# EAGLE design bitfury 10_1403 (EAGLE 6.5.0)
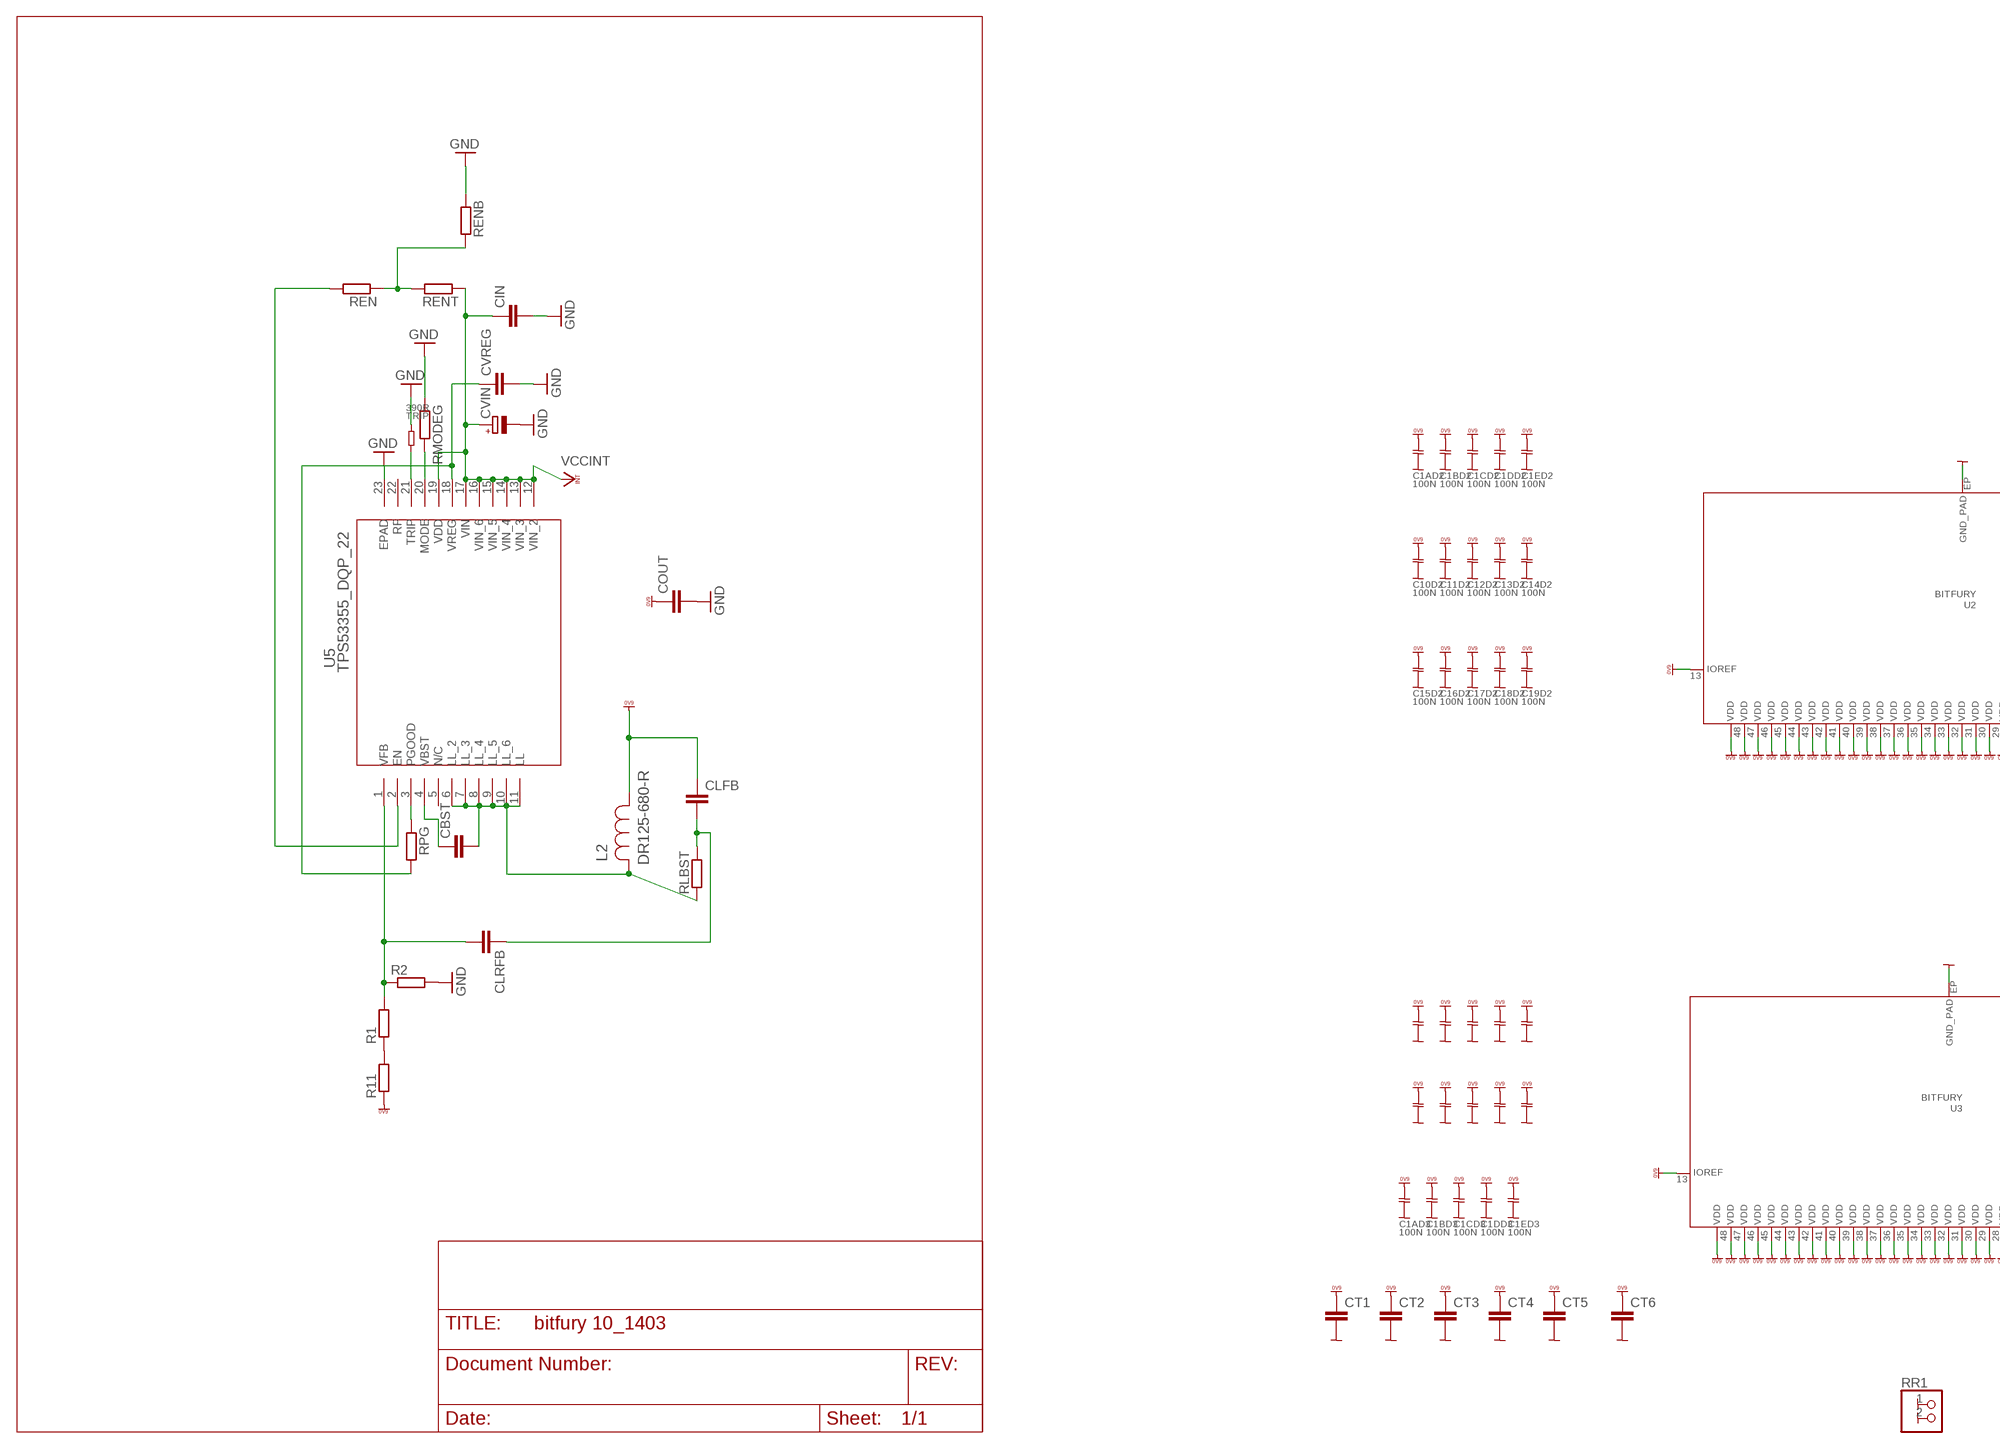
[diagram p0: schematic, sheet 1, part 1 of 3]
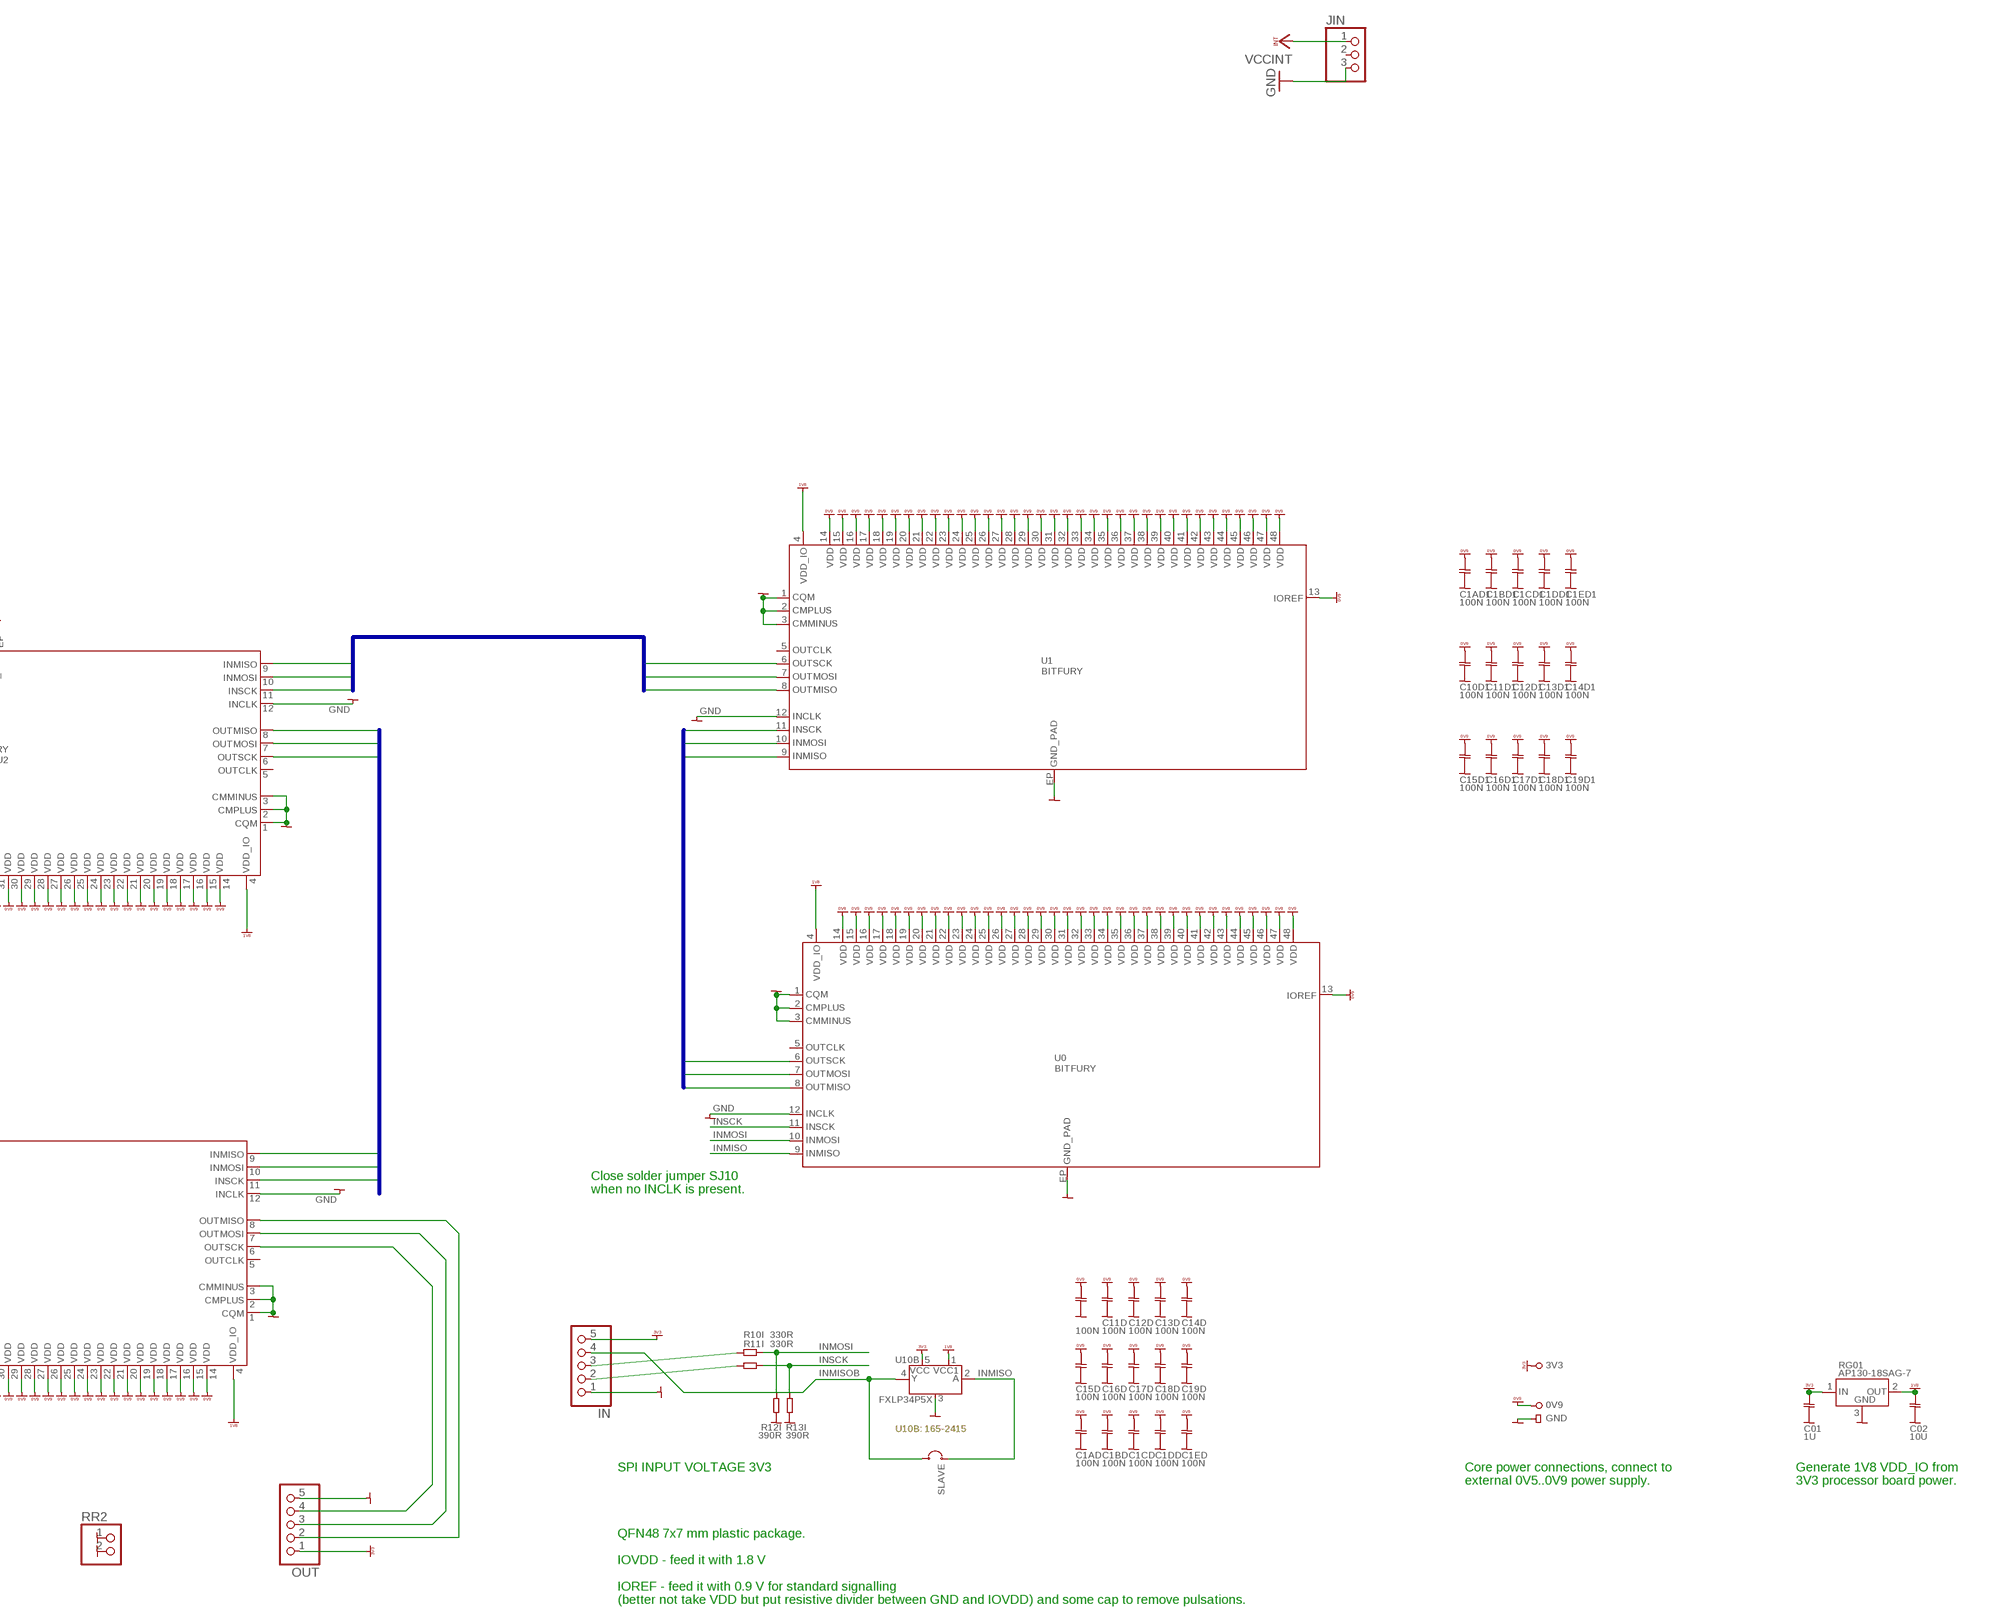
[diagram p1: schematic, sheet 1, part 2 of 3]
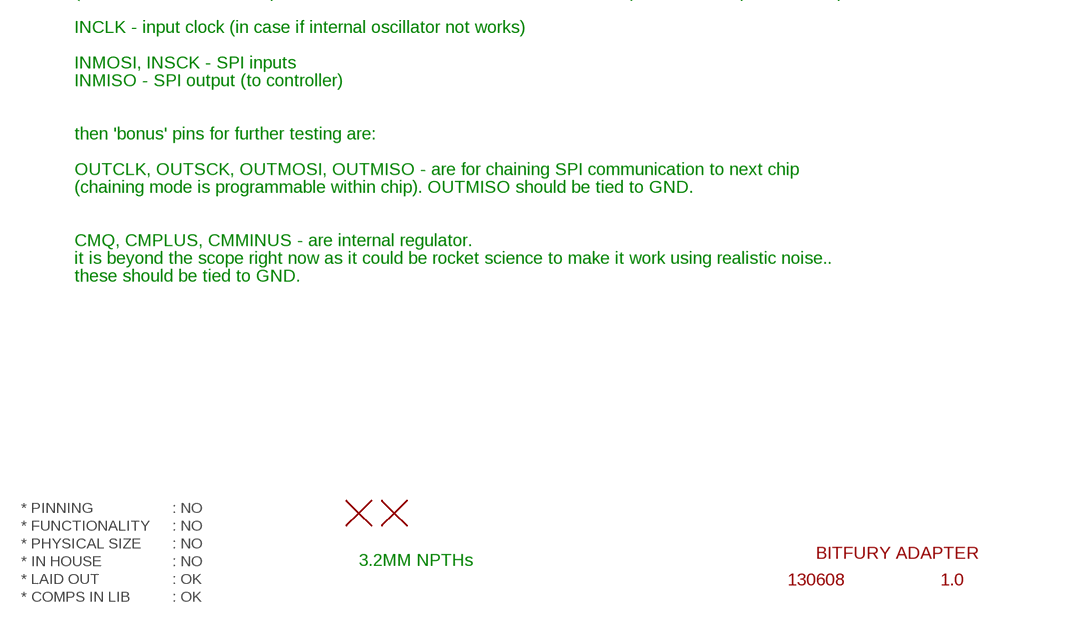
[diagram p2: schematic, sheet 1, part 3 of 3]

## Parts
0V9  PIN_TEST_BIG  [PAD_HOLE_BIG]
3V3  PIN_TEST_BIG  [PAD_HOLE_BIG]
C01  1U  CAP0603  [CAP0603]
C1AD  100N  CAP0402  [CAP0402]
C1AD1  100N  CAP0402  [CAP0402]
C1AD2  100N  CAP0402  [CAP0402]
C1AD3  100N  CAP0402  [CAP0402]
C1BD  100N  CAP0402  [CAP0402]
C1BD1  100N  CAP0402  [CAP0402]
C1BD2  100N  CAP0402  [CAP0402]
C1BD3  100N  CAP0402  [CAP0402]
C1CD  100N  CAP0402  [CAP0402]
C1CD1  100N  CAP0402  [CAP0402]
C1CD2  100N  CAP0402  [CAP0402]
C1CD3  100N  CAP0402  [CAP0402]
C1DD  100N  CAP0402  [CAP0402]
C1DD1  100N  CAP0402  [CAP0402]
C1DD2  100N  CAP0402  [CAP0402]
C1DD3  100N  CAP0402  [CAP0402]
C1ED  100N  CAP0402  [CAP0402]
C1ED1  100N  CAP0402  [CAP0402]
C1ED2  100N  CAP0402  [CAP0402]
C1ED3  100N  CAP0402  [CAP0402]
C02  10U  CAP0603  [CAP0603]
C10D  100N  CAP0402  [CAP0402]
C10D1  100N  CAP0402  [CAP0402]
C10D2  100N  CAP0402  [CAP0402]
C10D3  100N  CAP0402  [CAP0402]
C11D  100N  CAP0402  [CAP0402]
C11D1  100N  CAP0402  [CAP0402]
C11D2  100N  CAP0402  [CAP0402]
C11D3  100N  CAP0402  [CAP0402]
C12D  100N  CAP0402  [CAP0402]
C12D1  100N  CAP0402  [CAP0402]
C12D2  100N  CAP0402  [CAP0402]
C12D3  100N  CAP0402  [CAP0402]
C13D  100N  CAP0402  [CAP0402]
C13D1  100N  CAP0402  [CAP0402]
C13D2  100N  CAP0402  [CAP0402]
C13D3  100N  CAP0402  [CAP0402]
C14D  100N  CAP0402  [CAP0402]
C14D1  100N  CAP0402  [CAP0402]
C14D2  100N  CAP0402  [CAP0402]
C14D3  100N  CAP0402  [CAP0402]
C15D  100N  CAP0402  [CAP0402]
C15D1  100N  CAP0402  [CAP0402]
C15D2  100N  CAP0402  [CAP0402]
C15D3  100N  CAP0402  [CAP0402]
C16D  100N  CAP0402  [CAP0402]
C16D1  100N  CAP0402  [CAP0402]
C16D2  100N  CAP0402  [CAP0402]
C16D3  100N  CAP0402  [CAP0402]
C17D  100N  CAP0402  [CAP0402]
C17D1  100N  CAP0402  [CAP0402]
C17D2  100N  CAP0402  [CAP0402]
C17D3  100N  CAP0402  [CAP0402]
C18D  100N  CAP0402  [CAP0402]
C18D1  100N  CAP0402  [CAP0402]
C18D2  100N  CAP0402  [CAP0402]
C18D3  100N  CAP0402  [CAP0402]
C19D  100N  CAP0402  [CAP0402]
C19D1  100N  CAP0402  [CAP0402]
C19D2  100N  CAP0402  [CAP0402]
C19D3  100N  CAP0402  [CAP0402]
CBST  C-EUC0805  [C0805]
CIN  C-EUC1210  [C1210]
CLFB  C-EUC0805  [C0805]
CLRFB  C-EUC0805  [C0805]
COUT  C-EUC1210  [C1210]
CT1  C-EUC1206  [C1206]
CT2  C-EUC1206  [C1206]
CT3  C-EUC1206  [C1206]
CT4  C-EUC1206  [C1206]
CT5  C-EUC1206  [C1206]
CT6  C-EUC1206  [C1206]
CVIN  CPOL-EU153CLV-0505  [153CLV-0505]
CVREG  C-EUC0603  [C0603]
H1  HOLE_NPTH_3.2MM  [HOLE_NPTH_3.2MM]
H2  HOLE_NPTH_3.2MM  [HOLE_NPTH_3.2MM]
IN  PINHD-1X5/90  [1X05/90]
JIN  PINHD-1X3  [1X03]
L2  DR125-680-R  [INDM125125X600N]
OUT  PINHD-1X5/90  [1X05/90]
R1  R-EU_R0603  [R0603]
R2  R-EU_R0603  [R0603]
R10I  330R  RES0603  [RES0603]
R11  R-EU_R0603  [R0603]
R11I  330R  RES0603  [RES0603]
R12I  390R  RES0603  [RES0603]
R13I  390R  RES0603  [RES0603]
REN  R-EU_R0603  [R0603]
RENB  R-EU_R0603  [R0603]
RENT  R-EU_R0603  [R0603]
RG01  AP130-18SAG-7  [SOT23]
RLBST  R-EU_R0603  [R0603]
RMODEG  R-EU_R0603  [R0603]
RPG  R-EU_R0603  [R0603]
RR1  PINHD-1X2/90  [1X02/90]
RR2  PINHD-1X2/90  [1X02/90]
SLAVE  SJ2SJ2-S  [SJ2-S]
TRIP  390R  RES0603  [RES0603]
U0  BITFURY  [QNF48]
U1  BITFURY  [QNF48]
U2  BITFURY  [QNF48]
U3  BITFURY  [QNF48]
U5  TPS53355_DQP_22  [DQP22_5P479X3P24]
U10B  FXLP34P5X  [SOT23-5]
U$83  PIN_GND  [PAD_HOLE_SQR_1.8MM]

## Nets
B1B2C1: U0.6(6.OUTSCK) U1.11(11.INSCK)
B1B2C2: U0.7(7.OUTMOSI) U1.10(10.INMOSI)
B1B2C3: U0.8(8.OUTMISO) U1.9(9.INMISO)
B2B3C1: U1.6(6.OUTSCK) U2.11(11.INSCK)
B2B3C2: U1.7(7.OUTMOSI) U2.10(10.INMOSI)
B2B3C3: U1.8(8.OUTMISO) U2.9(9.INMISO)
B3B4C1: U2.6(6.OUTSCK) U3.11(11.INSCK)
B3B4C2: U2.7(7.OUTMOSI) U3.10(10.INMOSI)
B3B4C3: U2.8(8.OUTMISO) U3.9(9.INMISO)
GND: C01.2 C1AD1.2 C1AD2.2 C1AD3.2 C1AD.2 C1BD1.2 C1BD2.2 C1BD3.2 C1BD.2 C1CD1.2 C1CD2.2 C1CD3.2 C1CD.2 C1DD1.2 C1DD2.2 C1DD3.2 C1DD.2 C1ED1.2 C1ED2.2 C1ED3.2 C1ED.2 C02.2 C10D1.2 C10D2.2 C10D3.2 C10D.2 C11D1.2 C11D2.2 C11D3.2 C11D.2 C12D1.2 C12D2.2 C12D3.2 C12D.2 C13D1.2 C13D2.2 C13D3.2 C13D.2 C14D1.2 C14D2.2 C14D3.2 C14D.2 C15D1.2 C15D2.2 C15D3.2 C15D.2 C16D1.2 C16D2.2 C16D3.2 C16D.2 C17D1.2 C17D2.2 C17D3.2 C17D.2 C18D1.2 C18D2.2 C18D3.2 C18D.2 C19D1.2 C19D2.2 C19D3.2 C19D.2 CIN.2 COUT.2 CT1.2 CT2.2 CT3.2 CT4.2 CT5.2 CT6.2 CVIN.- CVREG.2 IN.1 JIN.3 OUT.5 R2.2 R12I.1 R13I.1 RENB.1 RG01.3(3.GND) RMODEG.1 RR1.1 RR1.2 RR2.1 RR2.2 TRIP.1 U0.1(1.QCM) U0.2(2.CMPLUS) U0.3(3.CMMINUS) U0.12(12.INCLK) U0.EP(EP.VSS_EP) U0.V1(EP.VSS_EP) U0.V2(EP.VSS_EP) U0.V3(EP.VSS_EP) U0.V4(EP.VSS_EP) U0.V5(EP.VSS_EP) U0.V6(EP.VSS_EP) U0.V7(EP.VSS_EP) U0.V8(EP.VSS_EP) U0.V9(EP.VSS_EP) U0.V10(EP.VSS_EP) U0.V11(EP.VSS_EP) U0.V12(EP.VSS_EP) U0.V13(EP.VSS_EP) U0.V14(EP.VSS_EP) U0.V15(EP.VSS_EP) U0.V16(EP.VSS_EP) U0.V17(EP.VSS_EP) U0.V18(EP.VSS_EP) U0.V19(EP.VSS_EP) U0.V20(EP.VSS_EP) U0.V21(EP.VSS_EP) U0.V22(EP.VSS_EP) U0.V23(EP.VSS_EP) U0.V24(EP.VSS_EP) U0.V25(EP.VSS_EP) U1.1(1.QCM) U1.2(2.CMPLUS) U1.3(3.CMMINUS) U1.12(12.INCLK) U1.EP(EP.VSS_EP) U1.V1(EP.VSS_EP) U1.V2(EP.VSS_EP) U1.V3(EP.VSS_EP) U1.V4(EP.VSS_EP) U1.V5(EP.VSS_EP) U1.V6(EP.VSS_EP) U1.V7(EP.VSS_EP) U1.V8(EP.VSS_EP) U1.V9(EP.VSS_EP) U1.V10(EP.VSS_EP) U1.V11(EP.VSS_EP) U1.V12(EP.VSS_EP) U1.V13(EP.VSS_EP) U1.V14(EP.VSS_EP) U1.V15(EP.VSS_EP) U1.V16(EP.VSS_EP) U1.V17(EP.VSS_EP) U1.V18(EP.VSS_EP) U1.V19(EP.VSS_EP) U1.V20(EP.VSS_EP) U1.V21(EP.VSS_EP) U1.V22(EP.VSS_EP) U1.V23(EP.VSS_EP) U1.V24(EP.VSS_EP) U1.V25(EP.VSS_EP) U2.1(1.QCM) U2.2(2.CMPLUS) U2.3(3.CMMINUS) U2.12(12.INCLK) U2.EP(EP.VSS_EP) U2.V1(EP.VSS_EP) U2.V2(EP.VSS_EP) U2.V3(EP.VSS_EP) U2.V4(EP.VSS_EP) U2.V5(EP.VSS_EP) U2.V6(EP.VSS_EP) U2.V7(EP.VSS_EP) U2.V8(EP.VSS_EP) U2.V9(EP.VSS_EP) U2.V10(EP.VSS_EP) U2.V11(EP.VSS_EP) U2.V12(EP.VSS_EP) U2.V13(EP.VSS_EP) U2.V14(EP.VSS_EP) U2.V15(EP.VSS_EP) U2.V16(EP.VSS_EP) U2.V17(EP.VSS_EP) U2.V18(EP.VSS_EP) U2.V19(EP.VSS_EP) U2.V20(EP.VSS_EP) U2.V21(EP.VSS_EP) U2.V22(EP.VSS_EP) U2.V23(EP.VSS_EP) U2.V24(EP.VSS_EP) U2.V25(EP.VSS_EP) U3.1(1.QCM) U3.2(2.CMPLUS) U3.3(3.CMMINUS) U3.12(12.INCLK) U3.EP(EP.VSS_EP) U3.V1(EP.VSS_EP) U3.V2(EP.VSS_EP) U3.V3(EP.VSS_EP) U3.V4(EP.VSS_EP) U3.V5(EP.VSS_EP) U3.V6(EP.VSS_EP) U3.V7(EP.VSS_EP) U3.V8(EP.VSS_EP) U3.V9(EP.VSS_EP) U3.V10(EP.VSS_EP) U3.V11(EP.VSS_EP) U3.V12(EP.VSS_EP) U3.V13(EP.VSS_EP) U3.V14(EP.VSS_EP) U3.V15(EP.VSS_EP) U3.V16(EP.VSS_EP) U3.V17(EP.VSS_EP) U3.V18(EP.VSS_EP) U3.V19(EP.VSS_EP) U3.V20(EP.VSS_EP) U3.V21(EP.VSS_EP) U3.V22(EP.VSS_EP) U3.V23(EP.VSS_EP) U3.V24(EP.VSS_EP) U3.V25(EP.VSS_EP) U5.23(EPAD) U10B.3(3.GND) U$83.1
INMISO: SLAVE.2 U0.9(9.INMISO) U10B.2(2.A)
INMISOB: IN.4 SLAVE.1 U10B.4(4.Y)
INMOSI: R10I.2 R12I.2 U0.10(10.INMOSI)
INSCK: R11I.2 R13I.2 U0.11(11.INSCK)
N$1: IN.2 R11I.1
N$2: IN.3 R10I.1
N$3: OUT.3 U3.7(7.OUTMOSI)
N$4: OUT.4 U3.6(6.OUTSCK)
N$5: CLFB.2 CLRFB.1 RLBST.2
N$6: CLRFB.2 R1.2 R2.1 U5.1(VFB)
N$7: R1.1 R11.2
N$15: REN.2 U5.2(EN)
N$16: REN.1 RENB.2 RENT.2
N$17: CVREG.1 RPG.2 U5.18(VREG)
N$18: TRIP.2 U5.21(TRIP)
N$19: RPG.1 U5.3(PGOOD)
N$20: OUT.2 U3.8(8.OUTMISO)
N$21: RMODEG.2 U5.20(MODE)
N$22: CBST.1 U5.4(VBST)
N$23: CBST.2 L2.2 RLBST.1 U5.6(LL_2) U5.7(LL_3) U5.8(LL_4) U5.9(LL_5) U5.10(LL_6) U5.11(LL)
VCCINT: CIN.1 CVIN.+ JIN.1 RENT.1 U5.12(VIN_2) U5.13(VIN_3) U5.14(VIN_4) U5.15(VIN_5) U5.16(VIN_6) U5.17(VIN) U5.19(VDD)
VDD_0V9: 0V9.1 C1AD1.1 C1AD2.1 C1AD3.1 C1AD.1 C1BD1.1 C1BD2.1 C1BD3.1 C1BD.1 C1CD1.1 C1CD2.1 C1CD3.1 C1CD.1 C1DD1.1 C1DD2.1 C1DD3.1 C1DD.1 C1ED1.1 C1ED2.1 C1ED3.1 C1ED.1 C10D1.1 C10D2.1 C10D3.1 C10D.1 C11D1.1 C11D2.1 C11D3.1 C11D.1 C12D1.1 C12D2.1 C12D3.1 C12D.1 C13D1.1 C13D2.1 C13D3.1 C13D.1 C14D1.1 C14D2.1 C14D3.1 C14D.1 C15D1.1 C15D2.1 C15D3.1 C15D.1 C16D1.1 C16D2.1 C16D3.1 C16D.1 C17D1.1 C17D2.1 C17D3.1 C17D.1 C18D1.1 C18D2.1 C18D3.1 C18D.1 C19D1.1 C19D2.1 C19D3.1 C19D.1 CLFB.1 COUT.1 CT1.1 CT2.1 CT3.1 CT4.1 CT5.1 CT6.1 L2.1 R11.1 U0.13(13.IOREF) U0.14(14.VDD) U0.15(15.VDD) U0.16(16.VDD) U0.17(17.VDD) U0.18(18.VDD) U0.19(19.VDD) U0.20(20.VDD) U0.21(21.VDD) U0.22(22.VDD) U0.23(23.VDD) U0.24(24.VDD) U0.25(25.VDD) U0.26(26.VDD) U0.27(27.VDD) U0.28(28.VDD) U0.29(29.VDD) U0.30(30.VDD) U0.31(31.VDD) U0.32(32.VDD) U0.33(33.VDD) U0.34(34.VDD) U0.35(35.VDD) U0.36(36.VDD) U0.37(37.VDD) U0.38(38.VDD) U0.39(39.VDD) U0.40(40.VDD) U0.41(41.VDD) U0.42(42.VDD) U0.43(43.VDD) U0.44(44.VDD) U0.45(45.VDD) U0.46(46.VDD) U0.47(47.VDD) U0.48(48.VDD) U1.13(13.IOREF) U1.14(14.VDD) U1.15(15.VDD) U1.16(16.VDD) U1.17(17.VDD) U1.18(18.VDD) U1.19(19.VDD) U1.20(20.VDD) U1.21(21.VDD) U1.22(22.VDD) U1.23(23.VDD) U1.24(24.VDD) U1.25(25.VDD) U1.26(26.VDD) U1.27(27.VDD) U1.28(28.VDD) U1.29(29.VDD) U1.30(30.VDD) U1.31(31.VDD) U1.32(32.VDD) U1.33(33.VDD) U1.34(34.VDD) U1.35(35.VDD) U1.36(36.VDD) U1.37(37.VDD) U1.38(38.VDD) U1.39(39.VDD) U1.40(40.VDD) U1.41(41.VDD) U1.42(42.VDD) U1.43(43.VDD) U1.44(44.VDD) U1.45(45.VDD) U1.46(46.VDD) U1.47(47.VDD) U1.48(48.VDD) U2.13(13.IOREF) U2.14(14.VDD) U2.15(15.VDD) U2.16(16.VDD) U2.17(17.VDD) U2.18(18.VDD) U2.19(19.VDD) U2.20(20.VDD) U2.21(21.VDD) U2.22(22.VDD) U2.23(23.VDD) U2.24(24.VDD) U2.25(25.VDD) U2.26(26.VDD) U2.27(27.VDD) U2.28(28.VDD) U2.29(29.VDD) U2.30(30.VDD) U2.31(31.VDD) U2.32(32.VDD) U2.33(33.VDD) U2.34(34.VDD) U2.35(35.VDD) U2.36(36.VDD) U2.37(37.VDD) U2.38(38.VDD) U2.39(39.VDD) U2.40(40.VDD) U2.41(41.VDD) U2.42(42.VDD) U2.43(43.VDD) U2.44(44.VDD) U2.45(45.VDD) U2.46(46.VDD) U2.47(47.VDD) U2.48(48.VDD) U3.13(13.IOREF) U3.14(14.VDD) U3.15(15.VDD) U3.16(16.VDD) U3.17(17.VDD) U3.18(18.VDD) U3.19(19.VDD) U3.20(20.VDD) U3.21(21.VDD) U3.22(22.VDD) U3.23(23.VDD) U3.24(24.VDD) U3.25(25.VDD) U3.26(26.VDD) U3.27(27.VDD) U3.28(28.VDD) U3.29(29.VDD) U3.30(30.VDD) U3.31(31.VDD) U3.32(32.VDD) U3.33(33.VDD) U3.34(34.VDD) U3.35(35.VDD) U3.36(36.VDD) U3.37(37.VDD) U3.38(38.VDD) U3.39(39.VDD) U3.40(40.VDD) U3.41(41.VDD) U3.42(42.VDD) U3.43(43.VDD) U3.44(44.VDD) U3.45(45.VDD) U3.46(46.VDD) U3.47(47.VDD) U3.48(48.VDD) ; supply symbol labelled VCC_0V9
VDD_1V8: C02.1 RG01.2(2.OUT) U0.4(4.VDD_IO) U1.4(4.VDD_IO) U2.4(4.VDD_IO) U3.4(4.VDD_IO) U10B.1(1.VCC1) ; supply symbol labelled VCC_1V8
VDD_3V3: 3V3.1 C01.1 IN.5 OUT.1 RG01.1(1.IN) U10B.5(5.VCC) ; supply symbol labelled VCC_3V3
Unconnected: JIN.2 U0.5(5.OUTCLK) U1.5(5.OUTCLK) U2.5(5.OUTCLK) U3.5(5.OUTCLK) U5.5(N/C) U5.22(RF)

## Buses
B1B2C[1..3]
B2B3C[1..3]
B3B4C[1..3]

## Notes on the sheet
- Close solder jumper SJ10
- when no INCLK is present.
- GND
- U10B: 165-2415
- SPI INPUT VOLTAGE 3V3 | Core power connections, connect to | Generate 1V8 VDD_IO from
- external 0V5..0V9 power supply. | 3V3 processor board power.
- QFN48 7x7 mm plastic package.
- IOVDD - feed it with 1.8 V
- IOREF - feed it with 0.9 V for standard signalling
- (better not take VDD but put resistive divider between GND and IOVDD) and some cap to remove pulsations.
- INCLK - input clock (in case if internal oscillator not works)
- INMOSI, INSCK - SPI inputs
- INMISO - SPI output (to controller)
- then 'bonus' pins for further testing are:
- OUTCLK, OUTSCK, OUTMOSI, OUTMISO - are for chaining SPI communication to next chip
- (chaining mode is programmable within chip). OUTMISO should be tied to GND.
- CMQ, CMPLUS, CMMINUS - are internal regulator.
- it is beyond the scope right now as it could be rocket science to make it work using realistic noise..
- these should be tied to GND.
- * PINNING | : NO
- * FUNCTIONALITY | : NO
- * PHYSICAL SIZE | : NO
- BITFURY ADAPTER
- * IN HOUSE | : NO | 3.2MM NPTHs
- * LAID OUT | : OK | 130608 | 1.0
- * COMPS IN LIB | : OK

## Library data of the parts
0V9 3V3 = 00-own_parts:PIN_TEST_BIG: Pin, test, hole 1.8mm, pad 2.5mm
C01 C02 = 00-own_parts:CAP0603
C1AD C1AD1-C1AD3 C1BD C1BD1-C1BD3 C1CD C1CD1-C1CD3 C1DD C1DD1-C1DD3 C1ED C1ED1-C1ED3 C10D C10D1-C10D3 C11D C11D1-C11D3 C12D C12D1-C12D3 C13D C13D1-C13D3 C14D C14D1-C14D3 C15D C15D1-C15D3 C16D C16D1-C16D3 C17D C17D1-C17D3 C18D C18D1-C18D3 C19D C19D1-C19D3 = 00-own_parts:CAP0402
CBST CIN CLFB CLRFB COUT CT1-CT6 CVREG = rcl:C-EU: CAPACITOR, European symbol
CVIN = rcl:CPOL-EU: POLARIZED CAPACITOR, European symbol
H1 H2 = 00-own_parts:HOLE_NPTH_3.2MM: Hole, NPTH, 3.2mm
IN OUT = pinhead:PINHD-1X5: PIN HEADER
JIN = pinhead:PINHD-1X3: PIN HEADER
L2 = SLC1175-301:DR125-680-R: POWER INDUCTOR; CURRENTRATING: 2.22A; INDUCTANCE: 68µH; MPN: DR125-680-R; OC_FARNELL: 1704120; OC_NEWARK: 52K7519; PACKAGE: SMD; SUPPLIER: COILTRONICS; TOLERANCE: ±20%
R1 R2 R11 REN RENB RENT RLBST RMODEG RPG = resistor:R-EU_: RESISTOR, European symbol
R10I R11I R12I R13I TRIP = 00-own_parts:RES
RG01 = 00-bitfury:AP130-18SAG-7: Regulator, 300mA, Vdrop: 400mV, Vin_max: 5V5, Vout: 1V8, SOT23, F#182-5304
RR1 RR2 = pinhead:PINHD-1X2: PIN HEADER
SLAVE = 00-own_parts:SJ2
U0 U1-U3 = 00-bitfury:BITFURY: MCU, Bitfury SHA256 Bitcoin hasher, 5GH/s, QNF48
U5 = tps53355:TPS53355_DQP_22; DATASHEETURL: http://www.ti.com/lit/gpn/TPS53355; DESCRIPTION: High-Efficiency 30-A Synchronous Buck Converter in PowerStack Package; FAMILY_NAME: STEP-DOWN REGULATOR; GENERIC_PART_NUMBER: TPS53355; INDUSTRY_STD_PKG_TYPE: SON; MANUFACTURER: Texas Instruments; MANUFACTURER_PART_NUMBER: tps53355_dqp_22; PACKAGE_DESIGNATOR: DQP; PIN_COUNT: 22; VENDOR: Texas Instruments
U10B = 00-bitfury:FXLP34P5X: Buffer, level shifting, single gate, SOT23-5, F#165-2415
U$83 = 00-own_parts:PIN_GND

## Board
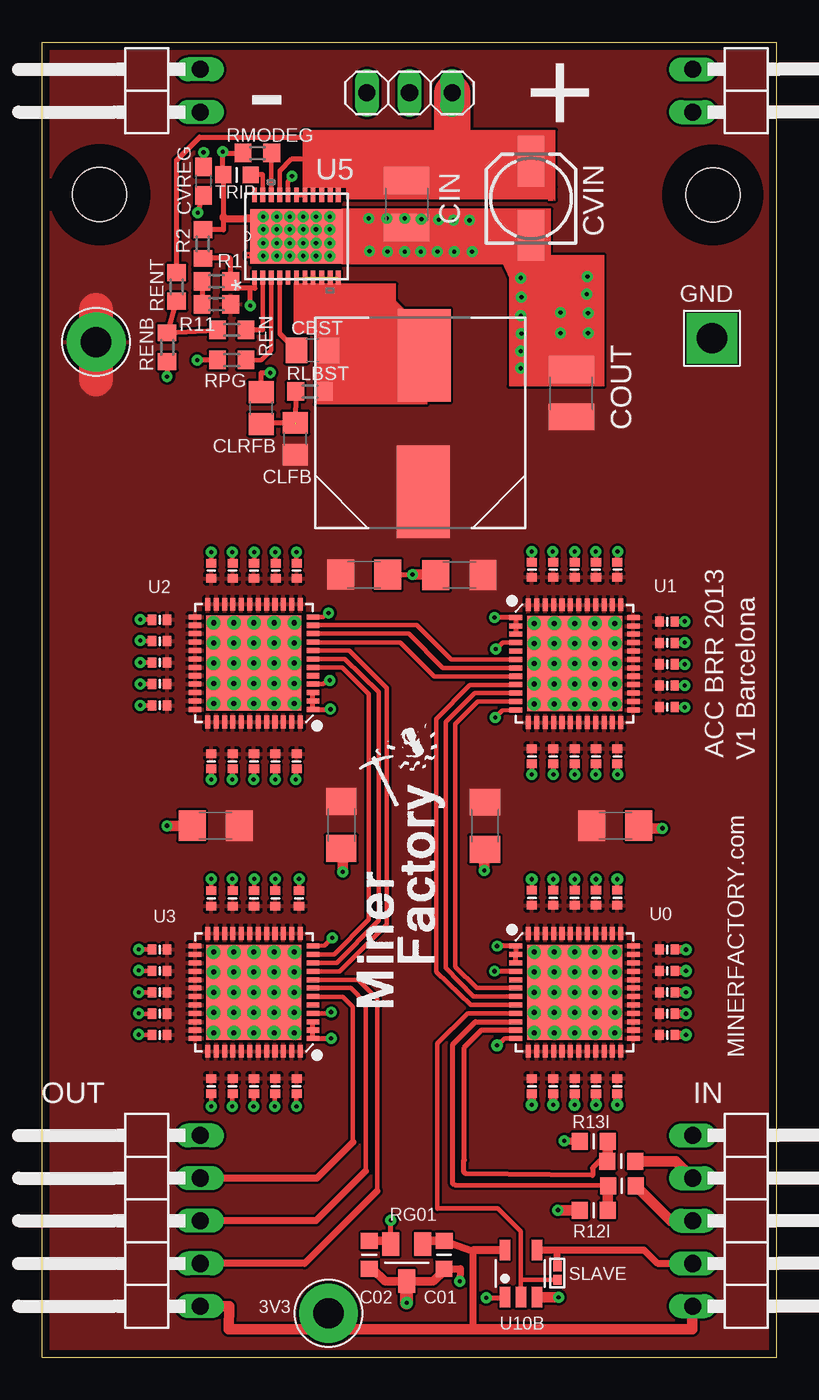
[diagram p3: board, top side]
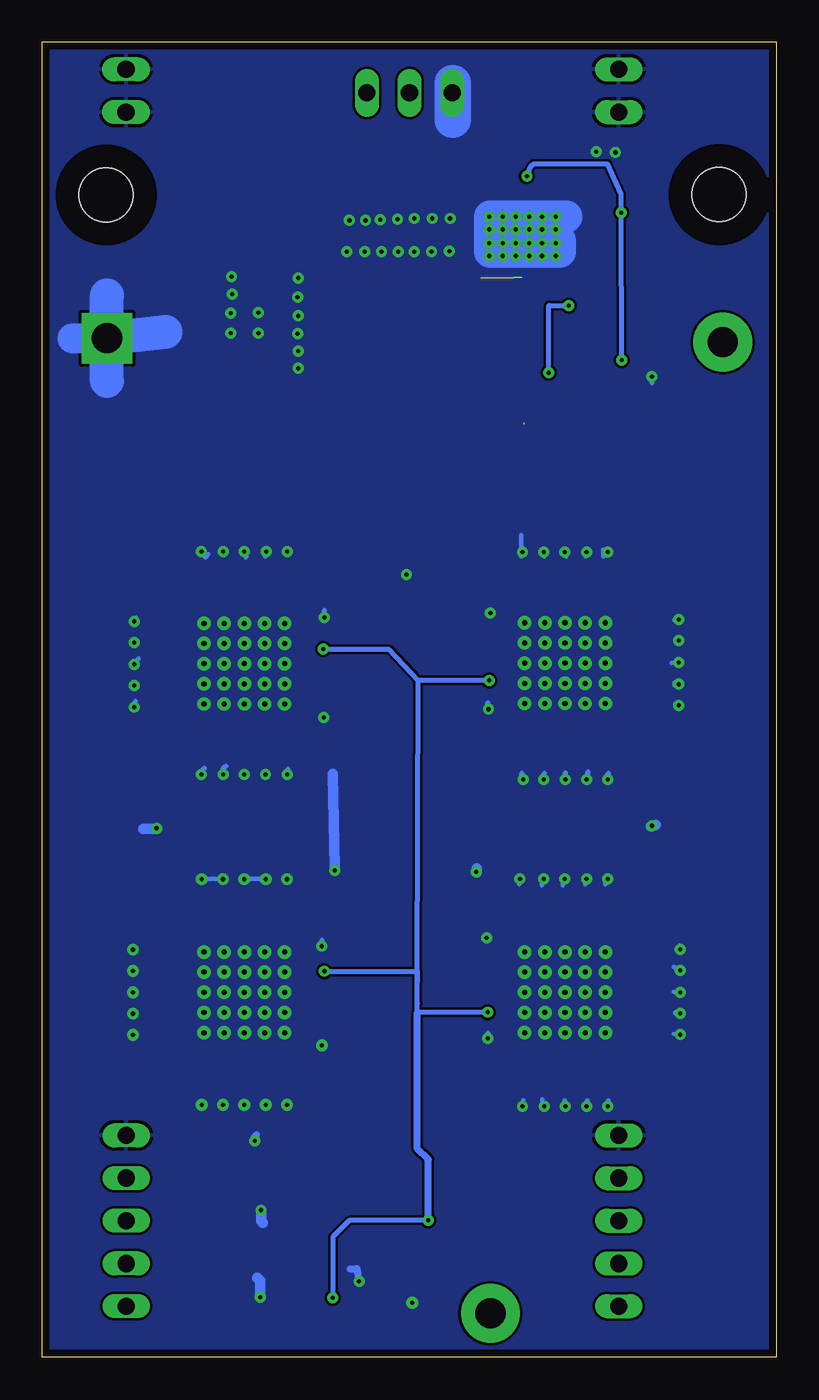
[diagram p4: board, bottom side, seen from below]

Size 43.69 x 78.23 mm. Coordinates in mm from the lower left corner, seen from the top.
Outline: 0,0 43.69,0 43.69,78.23 0,78.23 0,0
Copper layers (1*16): Top 0.018mm / dielectric 1.55mm / Bottom 0.018mm
Design rules "default *": minimum track width 0.15mm, minimum drill 0.25mm, track to track 0.15mm, track to pad 0.15mm, pad to pad 0.15mm, via to via 0.15mm, smd to smd 0mil, copper to edge 0.45mm, drill to drill 0.3mm, minimum pad ring 0.2mm, minimum via ring 0.2mm, stop-mask expansion 0.1mm, vias tented up to drill 0.4mm, thermal gap 0.2mm

### Footprints (pad centres in the part's own frame; a part is rotated, then mirrored left to right if it is on the bottom)
PAD_HOLE_BIG = drill 1.8 pad 3.5: 1 0,0
CAP0603 = smd 0.95 x 1: 1 -0.821,0.002; 2 0.822,0
CAP0402 = smd 0.5 x 0.6: 1 -0.45,0; 2 0.45,0
C0805 = smd 1.3 x 1.5: 1 -0.95,0; 2 0.95,0
C1210 = smd 1.6 x 2.7: 1 -1.4,0; 2 1.4,0
C1206 = smd 1.6 x 1.8: 1 -1.4,0; 2 1.4,0
153CLV-0505 = smd 3 x 1.6: + 2.2,0; - -2.2,0
C0603 = smd 1.1 x 1: 1 -0.85,0; 2 0.85,0
HOLE_NPTH_3.2MM = hole 3.2: 0,0
1X05/90 = drill 1.016 long: 1 -5.08,-3.81; 2 -2.54,-3.81; 3 0,-3.81; 4 2.54,-3.81; 5 5.08,-3.81
1X03 = drill 1.016 long: 1 -2.54,0; 2 0,0; 3 2.54,0
INDM125125X600N = smd 5.512 x 3.15: 1 -4.099,-0.177; 2 4.005,-0.244
R0603 = smd 1 x 1.1: 1 -0.85,0; 2 0.85,0
RES0603 = smd 0.95 x 1: 1 -0.821,0.002; 2 0.822,0
SOT23 = smd 1 x 1.4: 1 -0.95,-1.1; 2 0.95,-1.1; 3 0,1.1
1X02/90 = drill 1.016 long: 1 -1.27,-3.81; 2 1.27,-3.81
SJ2-S = smd 0.6 x 0.5: 1 -0.41,0; 2 0.41,0
QNF48 = smd 0.3 x 0.75: 1 -2.75,-3.5; 2 -2.25,-3.5; 3 -1.75,-3.5; 4 -1.25,-3.5; 5 -0.75,-3.5; 6 -0.25,-3.5; 7 0.25,-3.5; 8 0.75,-3.5; 9 1.25,-3.5; 10 1.75,-3.5; 11 2.25,-3.5; 12 2.75,-3.5; 25 2.75,3.5; 26 2.25,3.5; 27 1.75,3.5; 28 1.25,3.5; 29 0.75,3.5; 30 0.25,3.5; 31 -0.25,3.5; 32 -0.75,3.5; 33 -1.25,3.5; 34 -1.75,3.5; 35 -2.25,3.5; 36 -2.75,3.5 | smd 0.75 x 0.3: 13 3.5,-2.75; 14 3.5,-2.25; 15 3.5,-1.75; 16 3.5,-1.25; 17 3.5,-0.75; 18 3.5,-0.25; 19 3.5,0.25; 20 3.5,0.75; 21 3.5,1.25; 22 3.5,1.75; 23 3.5,2.25; 24 3.5,2.75; 37 -3.5,2.75; 38 -3.5,2.25; 39 -3.5,1.75; 40 -3.5,1.25; 41 -3.5,0.75; 42 -3.5,0.25; 43 -3.5,-0.25; 44 -3.5,-0.75; 45 -3.5,-1.25; 46 -3.5,-1.75; 47 -3.5,-2.25; 48 -3.5,-2.75 | smd 5.65 x 5.65: EP 0,0 | drill 0.3 pad 0.8: V1 -2.4,2.4; V2 -1.2,2.4; V3 0,2.4; V4 1.2,2.4; V5 2.4,2.4; V6 -2.4,1.2; V7 -1.2,1.2; V8 0,1.2; V9 1.2,1.2; V10 2.4,1.2; V11 -2.4,0; V12 -1.2,0; V13 0,0; V14 1.2,0; V15 2.4,0; V16 -2.4,-1.2; V17 -1.2,-1.2; V18 0,-1.2; V19 1.2,-1.2; V20 2.4,-1.2; V21 -2.4,-2.4; V22 -1.2,-2.4; V23 0,-2.4; V24 1.2,-2.4; V25 2.4,-2.4
DQP22_5P479X3P24 = smd 0.838 x 0.279: 1 -2.464,2.489; 2 -2.464,2.007; 3 -2.464,1.499; 4 -2.464,0.991; 5 -2.464,0.508; 6 -2.464,0; 7 -2.464,-0.508; 8 -2.464,-0.991; 9 -2.464,-1.499; 10 -2.464,-2.007; 11 -2.464,-2.489; 12 2.464,-2.489; 13 2.464,-2.007; 14 2.464,-1.499; 15 2.464,-0.991; 16 2.464,-0.508; 17 2.464,0; 18 2.464,0.508; 19 2.464,0.991; 20 2.464,1.499; 21 2.464,2.007; 22 2.464,2.489 | smd 3.251 x 5.486: 23 0,0 | drill 0.254: V 1.168,1.981; V_2 -1.168,-1.168; V_3 -1.168,-1.981; V_4 -1.168,-0.406; V_5 -1.168,0.406; V_6 -1.168,1.168; V_7 -1.168,1.981; V_8 -0.406,-1.981; V_9 -0.406,-1.168; V_10 -0.406,-0.406; V_11 -0.406,0.406; V_12 -0.406,1.168; V_13 -0.406,1.981; V_14 0.406,-1.981; V_15 0.406,-1.168; V_16 0.406,-0.406; V_17 0.406,0.406; V_18 0.406,1.168; V_19 0.406,1.981; V_20 1.168,-1.981; V_21 1.168,-1.168; V_22 1.168,-0.406; V_23 1.168,0.406; V_24 1.168,1.168
SOT23-5 = smd 0.62 x 1.22: 1 -0.95,-1.4; 2 0,-1.4; 3 0.95,-1.4; 4 0.95,1.4; 5 -0.95,1.4
PAD_HOLE_SQR_1.8MM = drill 1.8 pad 3 square: 1 0,0

### Placement (x,y rotation side)
0V9  3.21,60.39 270 top
3V3  17.03,2.63 0 top
C01  23.9,6.11 270 top
C1AD  34.2,27.34 90 top
C1AD1  29.12,35.76 270 top
C1AD2  10.06,35.45 270 top
C1AD3  10.06,16.14 270 top
C1BD  32.93,27.34 90 top
C1BD1  30.39,35.76 270 top
C1BD2  11.33,35.45 270 top
C1BD3  11.33,16.14 270 top
C1CD  31.66,27.34 90 top
C1CD1  31.66,35.76 270 top
C1CD2  12.6,35.45 270 top
C1CD3  12.6,16.14 270 top
C1DD  30.39,27.34 90 top
C1DD1  32.93,35.76 270 top
C1DD2  13.87,35.45 270 top
C1DD3  13.87,16.14 270 top
C1ED  29.12,27.34 90 top
C1ED1  34.2,35.76 270 top
C1ED2  15.14,35.45 270 top
C1ED3  15.14,16.14 270 top
C02  19.46,6.11 270 top
C10D  29.12,16.14 270 top
C10D1  29.12,46.85 90 top
C10D2  6.99,43.87 180 top
C10D3  6.99,24.26 180 top
C11D  30.39,16.14 270 top
C11D1  30.39,46.85 90 top
C11D2  6.99,42.6 180 top
C11D3  6.99,22.99 180 top
C12D  31.66,16.14 270 top
C12D1  31.66,46.85 90 top
C12D2  6.99,41.33 180 top
C12D3  6.99,21.72 180 top
C13D  32.93,16.14 270 top
C13D1  32.93,46.85 90 top
C13D2  6.99,40.06 180 top
C13D3  6.99,20.45 180 top
C14D  34.2,16.14 270 top
C14D1  34.2,46.85 90 top
C14D2  6.99,38.79 180 top
C14D3  6.99,19.18 180 top
C15D  37.17,19.18 0 top
C15D1  37.16,43.76 0 top
C15D2  15.14,46.79 90 top
C15D3  10.06,27.3 90 top
C16D  37.17,20.45 0 top
C16D1  37.17,42.49 0 top
C16D2  13.89,46.79 90 top
C16D3  11.33,27.3 90 top
C17D  37.17,21.72 0 top
C17D1  37.17,41.22 0 top
C17D2  12.6,46.79 90 top
C17D3  12.6,27.3 90 top
C18D  37.17,22.99 0 top
C18D1  37.17,39.95 0 top
C18D2  11.33,46.79 90 top
C18D3  13.87,27.3 90 top
C19D  37.17,24.26 0 top
C19D1  37.17,38.68 0 top
C19D2  10.06,46.79 90 top
C19D3  15.28,27.3 90 top
CBST  16.08,59.89 0 top
CIN  21.68,68.58 270 top
CLFB  15.05,54.64 90 top
CLRFB  13.03,56.46 90 top
COUT  31.47,57.34 90 top
CT1  24.82,46.53 180 top
CT2  10.33,31.62 180 top
CT3  17.79,31.66 270 top
CT4  26.33,31.62 270 top
CT5  34.09,31.62 0 top
CT6  19.15,46.56 0 top
CVIN  29.07,68.92 90 top
CVREG  9.6,69.95 90 top
H1  3.43,69.16 0 top
H2  39.88,69.14 0 top
IN  42.49,8.13 270 top
JIN  21.84,75.21 180 top
L2  22.48,55.59 90 top
OUT  5.59,8.13 90 top
R1  10.36,64.01 0 top
R2  9.56,66.22 90 top
R10I  34.47,10.21 180 top
R11  10.36,62.64 180 top
R11I  34.44,11.67 180 top
R12I  32.8,8.75 0 top
R13I  32.8,12.85 0 top
REN  11.28,61.11 0 top
RENB  7.43,60.08 90 top
RENT  8,63.67 270 top
RG01  21.68,5.63 180 top
RLBST  15.93,57.45 180 top
RMODEG  12.8,71.63 0 top
RPG  11.28,59.32 180 top
RR1  42.51,75.34 270 top
RR2  5.59,75.34 90 top
SLAVE  30.63,5.03 270 top
TRIP  11.58,70.33 0 top
U0  31.66,21.72 270 top
U1  31.66,41.26 270 top
U2  12.6,41.29 90 top
U3  12.6,21.72 90 top
U5  15.13,66.67 90 top
U10B  28.47,4.99 0 top
U$83  39.83,60.62 180 top
U$133  [MINERFACTORY]  24.04,20.57 90 top

### Tracks (layer width: path | path; a pad name or v marks a point on that pad's centre or on a via)
B1B2C1
  Top 0.254: U0.6 25.85,21.97 24.57,23.24 24.57,37.68 25.91,39.01 U1.11
B1B2C2
  Top 0.254: U0.7 25.62,21.47 24,23.16 24,37.8 25.72,39.51 U1.10
B1B2C3
  Top 0.254: U0.8 25.48,20.97 23.43,22.94 23.43,37.99 25.41,40.01 U1.9
B2B3C1
  Top 0.254: U1.6 24.32,41.51 22.29,43.55 U2.11
B2B3C2
  Top 0.254: U1.7 23.83,41.01 21.79,43.05 16.11,43.05 U2.10
B2B3C3
  Top 0.254: U1.8 23.3,40.51 21.3,42.52 16.12,42.52 U2.9
B3B4C1
  Top 0.254: U2.6 17.86,41.04 19.43,39.47 19.43,26.06 19.38,26 | U3.11 17.38,23.97 19.38,26 | 19.38,26 19.43,26.06
B3B4C2
  Top 0.254: U2.7 18.01,41.54 20,39.59 20,25.98 19.95,25.93 | U3.10 17.52,23.47 19.95,25.93 | 19.95,25.93 20,25.98
B3B4C3
  Top 0.254: U2.8 18.27,42.04 20.5,39.81 20.5,25.76 17.71,22.97 U3.9
GND  (via drill 0.25, 0.25 pad 0.7)
  Top 0.203: 29.28,23.47 29.44,23.62
  Top 0.254: C1DD.2 v30.39,28.45 | v31.66,28.45 C1CD.2 | C1BD.2 v32.93,28.45 | v34.2,28.45 C1AD.2 | C1ED.2 v29.12,28.45 | U0.V21 29.44,23.94 29.44,23.62 | U0.12 27.5,18.97 v27.05,18.55 | 27.27,38.4 v26.94,38.06 27.36,38.48 U1.12 | U2.12 16.73,44.04 v17.03,44.27 | U3.12 16.81,24.5 v17.26,24.96 | C10D1.2 29.12,47.92 v29.11,47.93 | C11D1.2 30.39,47.9 v30.37,47.93 | C12D1.2 v31.66,47.93 | C13D1.2 32.93,47.92 v32.92,47.93 | C14D1.2 34.2,47.92 v34.21,47.93 | C15D2.2 15.13,47.24 v15.13,47.89 | C16D2.2 13.87,47.24 v13.87,47.89 | C17D2.2 12.61,47.24 v12.61,47.89 | C18D2.2 11.32,47.24 v11.32,47.89 | C19D2.2 v10.06,47.89 | C10D2.2 5.75,43.87 v5.83,43.89 | C11D2.2 5.83,42.6 v5.83,42.63 | C12D2.2 v5.83,41.33 v5.83,41.34 | C13D2.2 5.83,40.06 v5.83,40.04 | C14D2.2 v5.83,38.79 | C19D3.2 v15.28,28.46 | C18D3.2 v13.87,28.46 | C17D3.2 12.61,27.75 v12.61,28.46 | C16D3.2 11.32,27.75 v11.32,28.46 | C15D3.2 v10.06,28.46 | C10D3.2 5.56,24.26 v5.75,24.27 | C11D3.2 5.75,22.99 v5.75,23.01 | C12D3.2 v5.75,21.72 | C13D3.2 5.75,20.45 v5.75,20.46 | C14D3.2 5.75,19.18 v5.75,19.2 | C1AD3.2 v10.06,14.94 | C1BD3.2 11.32,15.69 v11.32,14.94 | C1CD3.2 12.57,15.69 v12.57,14.94 | C1DD3.2 13.83,15.69 v13.83,14.94 | C1ED3.2 15.13,15.69 v15.13,14.94 | U5.23 20.41,66.67 CIN.2 26.36,67.87 CVIN.-
  Top 0.305: C1AD1.2 29.12,34.76 v29.11,34.67 | C1BD1.2 30.39,34.68 v30.4,34.67 | C1CD1.2 v31.66,34.67 | C1DD1.2 32.93,34.68 v32.92,34.67 | C1ED1.2 34.2,34.68 v34.21,34.67 | C19D1.2 38.14,38.68 v38.21,38.67 | C18D1.2 38.21,39.95 v38.21,39.97 | C17D1.2 v38.21,41.22 | C16D1.2 38.21,42.49 v38.21,42.52 | C15D1.2 38.21,43.76 v38.21,43.78 | C1AD2.2 v10.06,34.37 | C1BD2.2 11.32,35 v11.32,34.37 | C1CD2.2 12.57,34.96 v12.57,34.37 | C1DD2.2 v13.87,34.37 | C1ED2.2 15.09,35 v15.09,34.37 | v27.05,24.46 v27.05,24.47 U0.1 U0.2 U0.3 | U1.3 U1.2 U1.1 v26.9,44.01 | U2.3 U2.2 U2.1 17.14,38.54 v17.14,38.56 | U3.3 U3.2 U3.1 v17.18,18.97 | TRIP.1 10.74,70.33 | CVREG.2 v9.6,71.67 | TRIP.1 10.74,70.35 v10.74,71.7 10.82,71.63 RMODEG.1 | TRIP.1 10.78,70.31 10.78,67.89 10.78,67.74 | 10.78,67.74 10.82,67.7 | 12.5,67.7 13.53,66.67 U5.23 | RENB.1 v7.43,58.33 | COUT.2 31.47,59.09 | 10.78,67.74 10.78,67.07 R2.2 | CT6.2 v22.02,46.56
  Top 0.406: C01.2 24.87,5.29 v24.84,4.53 | R13I.1 31.07,12.85 v31.05,12.88 | 12.5,67.7 10.78,67.7 10.78,67.89
  Top 0.508: v38.28,24.26 C19D.2 | v38.28,22.99 C18D.2 | v38.28,21.72 C17D.2 | v38.28,20.45 C16D.2 | v38.28,19.18 C15D.2 | v34.2,15.02 C14D.2 | v32.93,15.02 C13D.2 | v31.66,15.02 C12D.2 | v30.39,15.02 C11D.2 | v29.12,15.02 C10D.2 | C01.2 23.9,5.16 23.27,4.52 RG01.3 21.67,4.52 20.41,4.52 19.64,5.29 C02.2
  Top 0.61: U10B.3 30.7,3.59 v30.71,3.58 | R12I.1 30.68,8.75 v30.67,8.76 | CT1.2 23.42,46.56 v22.02,46.56 | CT2.2 v7.43,31.62 | CT3.2 17.87,30.39 v17.87,28.88 | CT4.2 26.29,30.43 v26.29,28.96 | CT5.2 35.49,31.47 v36.88,31.47
  Top 0.762: v21.68,3.25 RG01.3
  Top 2.184: CVIN.- 28.08,66.15 31.24,59.32 31.47,59.09
  Bottom 0.254: v30.39,28.45 v31.66,28.45 | v32.93,28.45 v34.2,28.45 | v27.05,18.55 27.24,18.67 | v26.94,38.06 27.01,37.99 27.05,37.99 | v17.26,24.96 17.34,24.96 17.37,24.92 | v29.11,47.93 29.11,47.74 29.07,47.78 | v30.37,47.93 30.4,47.62 | v31.66,47.93 31.59,47.59 31.51,47.66 | v32.92,47.93 32.92,47.7 32.96,47.74 | v34.21,47.93 33.98,47.59 33.8,47.78 | v15.13,47.89 15.2,47.62 15.2,48.92 | v13.87,47.89 13.83,47.62 13.83,47.97 | v12.61,47.89 12.54,47.62 12.54,47.89 | v11.32,47.89 11.35,47.62 11.35,47.82 | v10.06,47.89 10.32,47.62 10.32,48.04 | v5.83,43.89 6.1,43.85 6.02,43.89 | 5.83,42.6 v5.83,42.63 5.83,42.75 | v5.83,41.34 6.25,41.3 | v5.83,40.04 6.1,40.01 6.1,40.12 | v5.83,38.79 6.06,38.75 6.06,38.86 | v15.28,28.46 15.32,28.12 15.32,28.27 | v13.87,28.46 13.98,28.12 13.98,28.08 | v12.61,28.46 12.72,28.12 12.72,28.08 | v11.32,28.46 11.39,28.12 | v10.06,28.46 10.21,28.12 10.21,28.31 | v5.75,24.27 5.98,24.27 5.79,24.5 | v5.75,23.01 6.13,23.24 | v5.75,21.72 6.13,21.75 | v5.75,20.46 6.06,20.46 6.06,20.54 | v5.75,19.2 6.13,19.24 | v10.06,14.94 10.02,15.28 | v11.32,14.94 11.28,15.28 | 12.61,15.28 v12.57,14.94 | v13.83,14.94 13.95,15.28 13.95,15.35 | v15.13,14.94 15.09,15.28
  Bottom 0.305: v29.11,34.67 29.07,34.98 | v30.4,34.67 30.4,34.86 | v31.66,34.67 31.74,34.86 | v32.92,34.67 32.92,35.01 32.77,35.17 | v34.21,34.67 34.14,34.94 34.02,35.05 | v38.21,38.67 38.14,38.71 38.14,39.01 | v38.21,39.97 38.25,40.01 38.25,40.12 | v38.21,41.22 37.95,41.57 | v38.21,42.52 38.1,42.56 38.1,42.48 | v38.21,43.78 38.1,43.81 38.1,44.01 | v10.06,34.37 10.02,34.75 10.02,34.67 10.06,34.67 | v11.32,34.37 11.24,34.75 11.24,34.82 | v12.57,34.37 12.57,34.78 | v13.87,34.37 13.83,34.75 | v15.09,34.37 15.16,34.75 15.16,34.71 | v27.05,24.46 27.05,24.8 | v26.9,44.01 26.9,44.42 | v17.14,38.56 17.18,38.56 17.18,38.94 | v17.18,18.97 17.18,19.28 | v9.6,71.67 9.49,71.82 9.72,71.82 | v7.43,58.33 7.43,57.95
  Bottom 0.406: v24.84,4.53 24.96,5.3 24.99,5.26 25.38,5.26 | v31.05,12.88 31.05,13.14 30.94,13.26
  Bottom 0.61: v30.71,3.58 30.71,4.55 30.89,4.73 | v30.67,8.76 30.67,8.12 30.56,8 | v22.02,46.56 22.02,46.52 | v7.43,31.62 7.51,31.59 7.2,31.66 | v17.87,28.88 17.83,29.07 17.83,28.84 | v26.29,28.96 26.29,29.11 26.4,34.71 | v36.88,31.47 36.88,31.43 37.68,31.43
  Bottom 1.778: 41.89,60.62 U$83.1
  Bottom 1.93: 12.54,67.86 17.03,67.86 17.03,65.76 12.92,65.76 12.92,66.41 15.96,66.41 15.96,66.56
  Bottom 2.032: U$83.1 39.83,63.16 | 39.83,58.08 U$83.1 | U$83.1 36.34,61
  Bottom 2.184: 19.28,75.78 19.28,73.61
  other vias: 19.43,67.74 19.47,65.8 20.54,65.76 21.56,65.76 22.52,65.76 23.51,65.76 24.5,65.76 20.5,67.74 21.56,67.74 22.56,67.7 23.58,67.67 24.46,67.63 25.41,67.63 25.57,65.76 28.46,64.2 28.5,63.06 28.46,61.95 28.5,60.88 28.46,59.86 28.46,58.83 32.42,64.27 30.82,60.92 32.46,60.92 32.46,62.1 30.82,62.14 32.38,63.25
  pour Bottom: 0,0 43.69,0 43.69,78.23 0,78.23
INMISO
  Top 0.254: U10B.2 28.47,4.53 | 28.47,4.53 28.47,7.49 27.09,8.88 23.55,8.88 23.51,8.84 23.51,18.67 25.3,20.46 U0.9 | SLAVE.2 28.56,4.62 28.47,4.53
INMISOB
  Top 0.406: U10B.4 30.75,6.39 | SLAVE.1 30.63,6.28 30.75,6.39 | 30.75,6.39 35.79,6.39 36.58,5.6 IN.4
INMOSI
  Top 0.305: R10I.2 24.57,10.25 24.42,10.32 24.42,18.63 25.76,19.96 U0.10
  Top 0.61: R12I.2 33.62,10.18 R10I.2
INSCK
  Top 0.305: U0.11 26.14,19.47 25.11,18.44 25.11,11.73 25.07,11.7 25.07,11.05 25.18,10.94 32.73,10.82 32.73,11.28 33.12,11.67 R11I.2
  Top 0.61: R11I.2 33.66,12.81 R13I.2
N$1
  Top 0.61: R11I.1 37.68,11.67 IN.2
N$2
  Top 0.61: R10I.1 37.38,8.13 IN.3
N$3
  Top 0.254: U3.7 18.34,21.97 19.24,21.07 19.24,11.09
  Top 0.406: 19.24,11.09 16.28,8.13 OUT.3
N$4
  Top 0.254: 16.1,21.45 17.87,21.45 18.48,20.84 18.48,12.8
  Top 0.305: U3.6 16.1,21.45
  Top 0.406: 18.48,12.8 16.34,10.67 OUT.4
N$5  (1 unrouted)
  Top 0.305: RLBST.2 15.05,55.52 | CLRFB.1 13.03,55.59 CLFB.2
N$6  (via drill 0.25)
  Top 0.254: U5.1 12.65,63.59
  Top 0.305: 12.65,63.59 12.38,63.59 | 12.38,63.59 11.63,63.59 arc-90 R1.2 11.21,65.37 R2.1 | CLRFB.2 13.03,58.56 v13.56,58.56 | v12.38,62.56 12.38,63.59
  Bottom 0.305: v13.56,58.56 13.56,62.56 v12.38,62.56
N$7
  Top 0.305: R1.1 R11.2
N$15
  Top 0.254: U5.2 13.12,61.12
  Top 0.305: 13.12,61.12 13.11,61.11 REN.2
N$16
  Top 0.305: REN.1 10.38,61.06 RENB.2 7.96,62.78 RENT.2
N$17  (via drill 0.25)
  Top 0.254: U5.18 14.62,69.9
  Top 0.305: RPG.2 v9.22,59.32 | 14.62,69.9 v14.86,70.26 | CVREG.1 9.56,69.25 v9.26,68.08
  Bottom 0.305: v9.22,59.32 v9.26,68.08 9.26,69.19 10.06,70.98 14.48,70.98 14.63,70.83 v14.86,70.26
N$18
  Top 0.254: U5.21 13.12,70.32
  Top 0.305: 13.12,70.32 13.11,70.33 13.11,70.35 TRIP.2
N$19
  Top 0.254: U5.3 13.63,59.92 13.03,59.32 RPG.1
N$20
  Top 0.254: U3.8 18.8,22.47 19.93,21.34 19.93,9.91
  Top 0.406: 19.93,9.91 15.61,5.59 OUT.2
N$21
  Top 0.254: U5.20 13.61,71.53 RMODEG.2
N$22
  Top 0.254: U5.4 14.13,60.89
  Top 0.305: 14.13,60.89 CBST.1
N$23  (5 unrouted)
  Top 0.254: 19.85,62.26 19.79,62.32
  Top 0.305: CBST.2 17.05,59.87 22.1,59.87 | 22.1,59.87 22.23,59.87 | RLBST.1 16.81,57.42 21.87,57.42 22.1,57.65 22.1,59.87 | U5.9 16.61,62.83 20.08,62.83 20.08,62.03
  Top 2.54: L2.2 22.51,59.59 22.23,59.87 20.08,62.03 19.85,62.26
VCCINT
  Top 0.254: U5.16 U5.17 | U5.19 14.13,70.56
  Top 0.305: CVIN.+ 28,69.22 24.35,70.21 24.1,70.28 23.34,70.19 CIN.1 20.6,71.06 17.98,71.06 17.61,70.69 U5.12 17.61,70.13 17.49,70.26 17.18,70.26 | RENT.1 8,71.21 9.37,72.58 15.54,72.58 15.62,72.5 15.62,71.28 | 15.62,71.28 15.62,70.18 | 15.62,70.18 U5.16 | 14.13,70.56 14.86,71.28 15.62,71.28 | 17.18,70.26 16.73,70.26 | 16.73,70.26 16.19,70.26 | 16.19,70.26 15.7,70.26 15.62,70.18 | U5.15 16.12,70.18 16.19,70.26 | U5.14 16.62,70.16 16.73,70.26 | U5.13 17.13,70.21 17.18,70.26
  Top 1.422: 23.23,70.19 23.34,70.19
  Top 2.184: JIN.1 24.38,70.25 24.35,70.21
VDD_0V9
  Top 2.032: 3.21,58.17 3.21,62.29
  pour Top: 0,0 43.69,0 43.69,78.23 0,78.23
  pour Top (no thermals): 20.35,55.24 24.65,55.09 24.77,48.16 20.5,48.31 20.65,54.67
  pour Top (no thermals): 29.38,57.26 33.68,57.11 33.68,53.91 29.6,53.42 29.53,56.12
  pour Top (no thermals): 13.83,54.6 16,54.67 16.12,52.16 13.83,52.12 13.68,54.25
  pour Top (no thermals): 25.11,47.89 27.28,47.97 27.43,45.3 25.15,45.26 24.96,47.55
  pour Top (no thermals): 16.61,47.85 18.78,47.93 18.94,45.26 16.65,45.22 16.46,47.51
  pour Top (no thermals): 31.62,32.84 33.79,32.92 33.95,30.25 31.66,30.21 31.47,32.5
  pour Top (no thermals): 16.69,34.29 18.86,34.37 19.01,31.7 16.73,31.66 16.54,33.95
  pour Top (no thermals): 10.63,32.88 12.8,32.96 12.95,30.29 10.67,30.25 10.48,32.54
  pour Top (no thermals): 25.3,34.33 27.47,34.4 27.62,31.74 25.34,31.7 25.15,33.99
VDD_1V8  (via drill 0.25)
  Top 0.254: 19.43,6.9 C02.1 | U1.4 27.39,42.51 v26.98,42.14 | U2.4 16.7,40.05 v17.11,40.27 | U3.4 17.18,20.47 v17.18,20.54
  Top 0.305: RG01.2 v20.73,8.15 | v26.4,3.54 27.48,3.54 U10B.1 | U0.4 27.39,22.97 v26.9,22.97
  Top 0.508: C02.1 20.53,6.93 RG01.2
  Top 0.762: 19.46,6.9 19.43,6.9
  Bottom 0.305: v20.73,8.15 25.41,8.15 26.4,7.16 v26.4,3.54 | 21.37,22.36 21.37,21.07 21.37,20.54 v17.18,20.54 | 21.37,22.36 21.37,22.75 21.34,40.27 | 21.34,40.27 23.05,42.1 26.94,42.1 v26.98,42.14 | v17.11,40.27 21.34,40.27 | v26.9,22.97 21.37,22.97 21.37,22.36
  Bottom 0.406: v20.73,8.15 20.73,11.77 21.37,12.42 21.37,20.54
VDD_3V3
  Top 0.305: RG01.1
  Top 0.406: C01.1 25.57,6.36 26.71,6.36 27.5,6.36 U10B.5 25.6,6.39 25.6,1.68 | 3V3.1 17.03,1.71 17.07,1.68
  Top 0.508: C01.1 22.83,6.93 RG01.1
  Top 0.61: OUT.1 11.12,3.05 11.09,1.68 17.07,1.68 25.6,1.68 38.65,1.68 IN.5
(copper drawn outside any net)
  shapes: Top area x11

### Text on the board
tPlace: Barcelona | ACC BRR 2013 | V1 | MINERFACTORY.com
tNames: - | +
_tplace: GND